# EAGLE design AC_DIMMER (EAGLE 8.3.1)
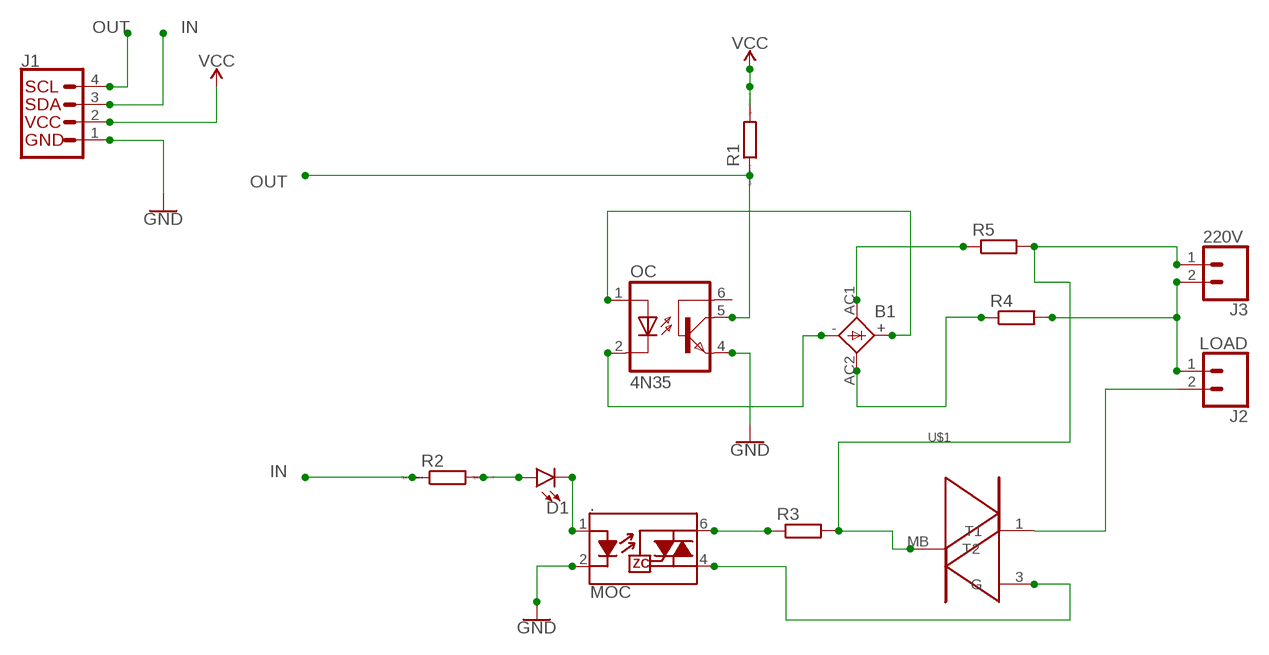
[diagram p0: schematic, sheet 1]

## Parts
.  MOC  TRIAC_OPTOCOUPLER-MOC3063SM  [DIP8SMD]
B1  2KBP  [2KBP]
D1  LED-FKIT-1206  [FKIT-LED-1206]
J1  QWIIC_CONNECTORJS-1MM  [1X04_1MM_RA]
J2  LOAD  CONN_023.5MM  [SCREWTERMINAL-3.5MM-2]
J3  220V  CONN_023.5MM  [SCREWTERMINAL-3.5MM-2]
OC  4N35  4N35SM  [DIL6-SMD]
R1  RR0603  [R0603]
R2  RR0603  [R0603]
R3  R-EU_R3225  [R3225]
R4  R-EU_R3225  [R3225]
R5  R-EU_R3225  [R3225]
U$1  BT136S-600ETRIACA  [SOT428]

## Nets
GND: ..2(K) J1.1(GND) OC.4(EMI)
IN: J1.3(SDA) R2.1
N$1: B1.+ OC.1(A)
N$2: B1.- OC.2(C)
N$3: J2.2 U$1.1(T1)
N$4: D1.A R2.2
N$5: ..1(A) D1.C
N$6: J2.1 J3.2 R4.2
N$7: ..6(T1) R3.1
N$8: B1.AC1 R5.1
N$9: B1.AC2 R4.1
N$11: ..4(T2) U$1.3(G)
N$12: J3.1 R3.2 R5.2 U$1.MB(T2)
OUT: J1.4(SCL) OC.5(COL) R1.1
VCC: J1.2(VCC) R1.2
Unconnected: OC.6(BAS)

## Library data of the parts
. = SparkFun-DiscreteSemi:TRIAC_OPTOCOUPLER: Zero-cross Triac Driver Optocoupler SImplifies logic control of 115/240 VAC power. Zero voltage crossing to minimize conducted and radiated line noise. Link to datasheet <http://www.mouser.com/ds/2/149/MOC3063M-196324.pdf> Emitter: VF: 1.3V IFT: 5 mA Detector: VDRM: 600V ITSM: 1A VISO: 4170V DV⁄dt: 1500V⁄µs SparkFun Products: SparkFun EL Sequencer <https://www.sparkfun.com/products/12781> SparkFun EL Escudo Dos <https://www.sparkfun.com/products/10878>; PROD_ID: IC-10683
B1 = rectifier:2KBP: RECTIFIER grid 3 x 3,81 mm
D1 = SparkFun-LED:LED: LED (Generic) Standard schematic elements and footprints for 5mm, 3mm, 1206, and 0603 sized LEDs. Generic LEDs with no color specified.
J1 = SparkFun-Connectors:QWIIC_CONNECTOR: SparkFun I2C Standard Qwiic Connector An SMD 1mm pitch JST connector makes it easy and quick (get it? Qwiic?) to connect I2C devices to each other. The Qwiic system <http://www.sparkfun.com/qwiic> enables fast and solderless connection between popular platforms and various sensors and actuators. We carry 200mm <https://www.sparkfun.com/products/14204>, 100mm <https://www.sparkfun.com/products/14205>, 50mm <https://www.sparkfun.com/products/14206>, and breadboard friendly <https://www.sparkfun.com/products/14207> Qwiic cables. We also offer 10 pcs strips <https://www.sparkfun.com/products/14323> the SMD connectors.
J2 J3 = SparkFun-Connectors:CONN_02: Multi connection point. Often used as Generic Header-pin footprint for 0.1 inch spaced/style header connections On any of the 0.1 inch spaced packages, you can populate with these: Break Away Headers - Straight <https://www.sparkfun.com/products/116> (PRT-00116) Break Away Male Headers - Right Angle <https://www.sparkfun.com/products/553> (PRT-00553) Female Headers <https://www.sparkfun.com/products/115> (PRT-00115) Break Away Headers - Machine Pin <https://www.sparkfun.com/products/117> (PRT-00117) Break Away Female Headers - Swiss Machine Pin <https://www.sparkfun.com/products/743> (PRT-00743) For SCREWTERMINALS and SPRING TERMINALS visit here: Screw Terimnals on SparkFun.com <https://www.sparkfun.com/search/results?term=Screw+Terminals> (5mm/3.5mm/2.54mm spacing) This device is also useful as a general connection point to wire up your design to another part of your project. Our various solder wires solder well into these plated through hole pads. Hook-Up Wire - Assortment (Stranded, 22 AWG) <https://www.sparkfun.com/products/11375> (PRT-11375) Hook-Up Wire - Assortment (Solid Core, 22 AWG) <https://www.sparkfun.com/products/11367> (PRT-11367) View the entire wire category on our website here <https://www.sparkfun.com/categories/141> Special notes: Molex polarized connector foot print use with: PRT-08233 with associated crimp pins and housings. 2.54_SCREWTERM for use with PRT-10571. 3.5mm Screw Terminal footprints for PRT-08084 5mm Screw Terminal footprints for use with PRT-08432; PROD_ID: CONN-08399
OC = optocoupler:4N*?M: General Purpose 6-Pin Phototransistor Optocouplers Source: http://www.fairchildsemi.com/ds/4N/4N35-M.pdf; MF: FAIRCHILD SEMICONDUCTOR; MPN: 4N35S-M; OC_FARNELL: 1021179; OC_NEWARK: 67K2285
R1 R2 = eagle-ltspice:R: RESISTOR, European symbol; SPICEMODEL: NONE; SPICEPREFIX: R
R3-R5 = resistor:R-EU_: RESISTOR, European symbol
U$1 = SMDs:BT136S-600E: Planar passivated sensitive gate four quadrant triac in a SOT428 (DPAK) surfacemountable plastic package intended for use in general purpose bidirectional switching and phase control applications

## Net classes
0 default: clearance 0.205 mm

## Board
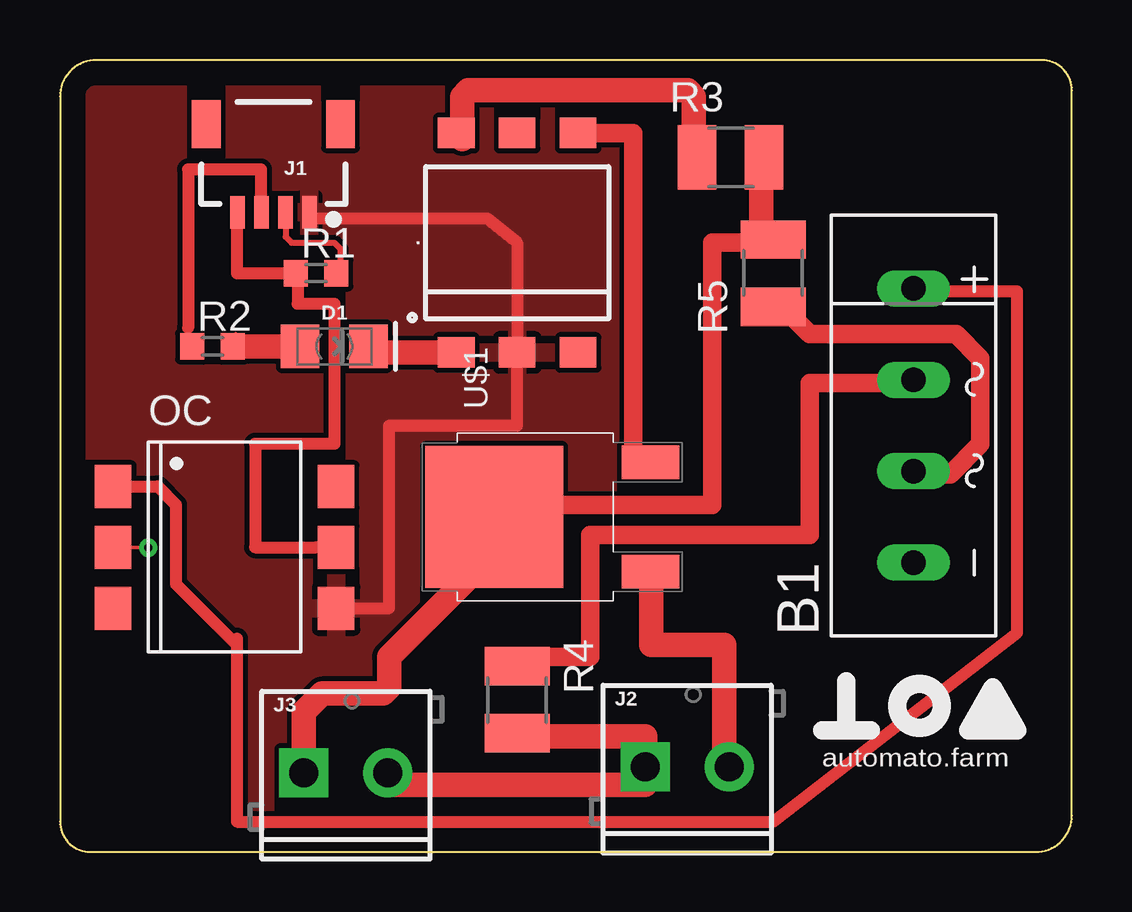
[diagram p1: board, top side]
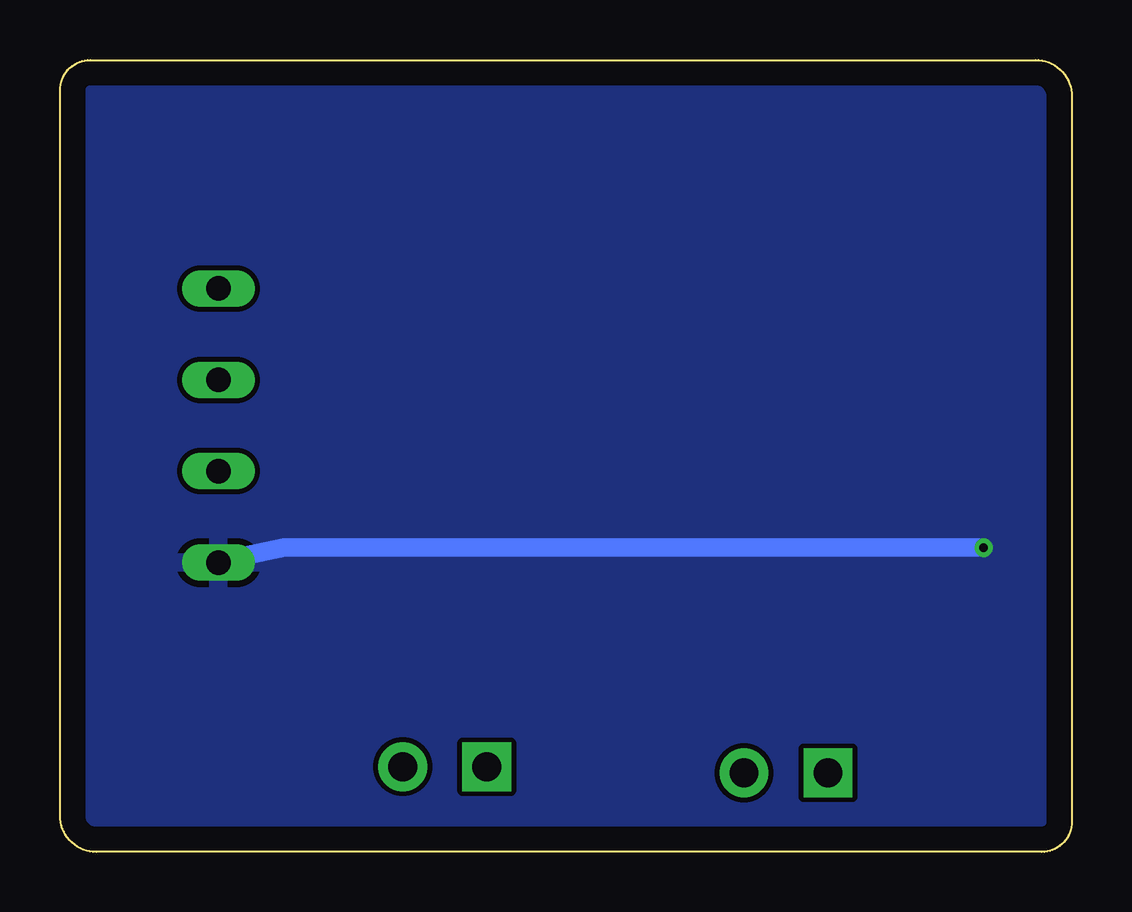
[diagram p2: board, bottom side, seen from below]

Size 42.16 x 33.02 mm. Coordinates in mm from the lower left corner, seen from the top.
Outline: 0,31.5 0,1.27 arc90 1.27,0 40.64,0 arc90 42.16,1.52 42.16,31.75 arc90 40.89,33.02 1.52,33.02 arc90 0,31.5
Copper layers (1*16): Top 0.035mm / dielectric 1.5mm / Bottom 0.035mm
Design rules "default": minimum track width 6mil, minimum drill 0.35mm, track to track 6mil, track to pad 6mil, pad to pad 6mil, via to via 6mil, smd to smd 6mil, copper to edge 40mil, drill to drill 6mil, minimum pad ring 10mil, minimum via ring 8mil, stop-mask expansion 4mil, vias tented up to drill 0mil, thermal gap 10mil

### Footprints (pad centres in the part's own frame; a part is rotated, then mirrored left to right if it is on the bottom)
DIP8SMD = smd 1.524 x 1.27: 1 -2.54,-4.572; 2 0,-4.572; 3 2.54,-4.572; 4 2.54,4.572; 5 0,4.572; 6 -2.54,4.572
2KBP = drill 1.016 long: + 5.715,0; - -5.715,0; AC1 -1.905,0; AC2 1.905,0
FKIT-LED-1206 = smd 1.6 x 1.803: A -1.422,0; C 1.422,0
1X04_1MM_RA = smd 0.6 x 1.35: 1 -1.5,0; 2 -0.5,0; 3 0.5,0; 4 1.5,0 | smd 1.2 x 2: NC1 2.8,-3.675; NC2 -2.8,-3.675
SCREWTERMINAL-3.5MM-2 = drill 1.2 pad 2.032 square: 1 0,0 | drill 1.2 pad 2.032: 2 3.5,0
DIL6-SMD = smd 1.78 x 1.52: 1 -2.54,-4.645; 2 0,-4.645; 3 2.54,-4.645; 4 2.54,4.645; 5 0,4.645; 6 -2.54,4.645
R0603 = smd 1 x 1.1: 1 -0.85,0; 2 0.85,0
R3225 = smd 1.6 x 2.7: 1 -1.4,0; 2 1.4,0
SOT428 = smd 1.4 x 2.4: 1 -2.285,-4.8; 3 2.285,-4.8 | smd 5.9 x 5.75: MB 0,1.725

### Placement (x,y rotation side)
.  19.05,25.4 0 top
B1  35.56,17.78 90 top
D1  11.43,21.08 0 top
J1  8.89,26.67 180 top
J2  24.38,3.56 0 top
J3  10.16,3.3 0 top
OC  6.86,12.7 270 top
R1  10.67,24.13 0 top
R2  6.35,21.08 0 top
R3  27.94,28.96 0 top
R4  19.05,6.35 270 top
R5  29.72,24.13 90 top
U$1  19.81,13.97 90 top

### Tracks (layer width: path | path; a pad name or v marks a point on that pad's centre or on a via)
GND
  Top 0.152: J1.1 10.37,26.63 10.41,26.42 | ..2 19.12,20.73 19.12,20.55 19.05,20.32 | OC.4 11.08,10.19 11.26,10.19 11.43,10.16
  Top 0.508: 11.43,10.16 13.72,10.16 13.72,17.78 19.05,17.78 19.05,20.32 | 10.41,26.42 17.78,26.42 19.05,25.4 ..2
  pour Top: 0,32.77 0,0 42.42,0.25 42.16,33.02
IN
  Top 0.152: R2.1 5.36,21.62 5.33,21.84 | 8.38,26.92 8.4,26.8 J1.3
  Top 0.508: 8.38,26.92 8.38,28.45 5.33,28.45 5.33,21.84
N$1
  Top 0.152: OC.1 1.79,15.37 1.79,15.24 | 36.07,23.37 35.92,23.41 35.56,23.41 B1.+
  Top 0.508: 7.37,8.89 7.37,8.64 | 7.37,8.64 7.37,1.27 29.72,1.27 39.88,9.14 39.88,23.37 36.07,23.37 | 1.78,15.24 1.79,15.24 4.06,15.24 4.83,14.48 4.83,11.18 7.37,8.64
N$2  (via drill 0.35)
  Top 0.152: v3.68,12.69 3.56,12.69 OC.2
  Bottom 0.152: 35.38,12.15 B1.-
  Bottom 0.762: v3.68,12.69 32.81,12.69 35.38,12.15
  pour Bottom: 0,32.51 -0.25,0 42.16,0.25 41.91,33.27 0,33.27
N$3
  Top 0.152: U$1.1 24.66,11.79 24.64,11.68 | J2.2 27.88,3.57 J2.2
  Top 1.016: 24.64,11.68 24.64,8.64 27.69,8.64 27.69,3.56 J2.2 27.94,3.56
N$4
  Top 0.152: R2.2 7.33,21.62 7.37,21.08 | 9.65,21.08 10.01,21.62 D1.A
  Top 1.016: 7.37,21.08 9.65,21.08
N$5
  Top 0.152: ..1 16.62,20.91 16.26,20.83 | 13.21,21.08 12.87,21.44 D1.C
  Top 1.016: 13.21,21.08 13.21,20.83 16.26,20.83
N$6
  Top 0.152: R4.2 19.12,5 19.12,4.83 | J2.1 24.48,3.57 24.38,3.3 | 13.76,2.79 13.76,3.22 J3.2
  Top 1.016: 19.05,4.83 19.12,4.83 24.38,4.83 J2.1 | 13.72,3.3 13.72,2.79 13.76,2.79 24.38,2.79 24.38,3.3
N$7
  Top 0.152: ..6 16.62,30.02 16.76,30.02 | 26.42,29.46 26.45,29.13 R3.1
  Top 1.016: 16.76,29.72 16.76,30.02 16.76,31.5 17.02,31.75 26.16,31.75 26.42,31.5 26.42,29.46
N$8
  Top 0.152: R5.1 29.31,22.7 29.46,22.61 | 35.56,15.75 35.56,15.73 B1.AC1
  Top 0.508: 29.46,22.61 30.23,22.61 | 35.56,15.75
  Top 0.762: 30.23,22.61 31.24,21.59 37.34,21.59 38.35,20.57 38.35,17.02 37.08,15.75 35.56,15.75
N$9
  Top 0.152: R4.1 19.12,7.86 19.84,7.86 20.07,8.13 | 35.05,19.56 35.38,19.66 B1.AC2
  Top 0.762: 20.07,8.13 22.1,8.13 22.1,13.21 31.24,13.21 31.24,19.56 35.05,19.56
N$11
  Top 0.152: ..4 21.62,30.02 21.84,29.97 | 23.88,16.26 23.95,16.26 U$1.3
  Top 0.762: 21.84,29.97 23.88,29.97 23.88,16.26
N$12
  Top 0.152: 29.31,25.73 29.21,25.91 | 29.31,25.73 R5.2 | 29.31,25.73 29.21,25.4 | 17.33,14.12 17.69,14.47 18.94,14.47 19.3,14.48 | R3.2 29.31,28.95 29.21,28.45 | 17.78,13.94 18.05,13.94 U$1.MB
  Top 0.762: 19.3,14.48 27.18,14.48 27.18,25.4 29.21,25.4
  Top 1.016: 29.21,28.45 29.21,25.91 | 19.3,14.48 17.78,14.48 17.78,13.94 17.78,12.19 13.72,8.13 13.72,6.86 13.46,6.6 10.92,6.6 10.16,5.84 J3.1
OUT
  Top 0.152: OC.5 10.9,12.69 10.72,12.69 10.67,12.7 | 9.65,24.13 R1.1 9.65,23.95 9.83,23.95 9.91,23.88 | 7.37,26.42 7.5,26.63 J1.4
  Top 0.508: 7.37,26.42 7.37,24.13 9.65,24.13 | 9.91,23.88 9.91,22.86 11.43,22.86 11.43,17.02 8.13,17.02 8.13,12.7 10.67,12.7
VCC
  Top 0.152: R1.2 11.62,24.12 11.68,24.12 | 9.4,26.09 9.47,26.09 9.47,26.63 J1.2
  Top 0.254: 9.4,26.16 9.4,26.09 9.4,25.65 9.65,25.4 11.43,25.4 11.68,25.15 11.68,24.12 11.68,23.88

### Text on the board
tPlace: automato.farm